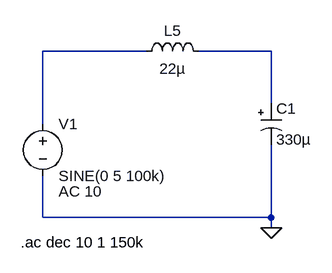
[diagram p0: schematic Output Filter AC Analysis.asc]
Output Filter AC Analysis.asc, the LTspice schematic file:
Version 4
SHEET 1 2016 1428
WIRE 1456 -128 1296 -128
WIRE 1648 -128 1536 -128
WIRE 1648 -48 1648 -128
WIRE 1296 -16 1296 -128
WIRE 1296 128 1296 64
WIRE 1648 128 1648 16
WIRE 1648 128 1296 128
WIRE 1648 144 1648 128
FLAG 1648 144 0
SYMBOL ind 1440 -112 R270
WINDOW 0 32 56 VTop 2
WINDOW 3 5 56 VBottom 2
SYMATTR InstName L5
SYMATTR Value 22µ
SYMBOL polcap 1632 -48 R0
WINDOW 3 24 56 Left 2
SYMATTR Value 330µ
SYMATTR InstName C1
SYMATTR Description Capacitor
SYMATTR Type cap
SYMATTR SpiceLine V=100 Irms=720m Rser=0.09 Lser=0 mfg="Nichicon" pn="UPR2A331MRH" type="Al electrolytic"
SYMBOL voltage 1296 -32 R0
WINDOW 123 24 120 Left 2
WINDOW 39 0 0 Left 0
SYMATTR InstName V1
SYMATTR Value SINE(0 5 100k)
SYMATTR Value2 AC 10
TEXT 1262 166 Left 2 !.ac dec 10 1 150k

The netlist it stands for:
* Output Filter AC Analysis.asc
L5 N001 N002 22µ
C1 N002 0 330µ V=100 Irms=720m Rser=0.09 Lser=0 mfg="Nichicon" pn="UPR2A331MRH" type="Al electrolytic"
V1 N001 0 SINE(0 5 100k) AC 10
.ac dec 10 1 150k
.backanno
.end